# Altium schematic sheet 省电模块版v1.0.SchDoc
size A4
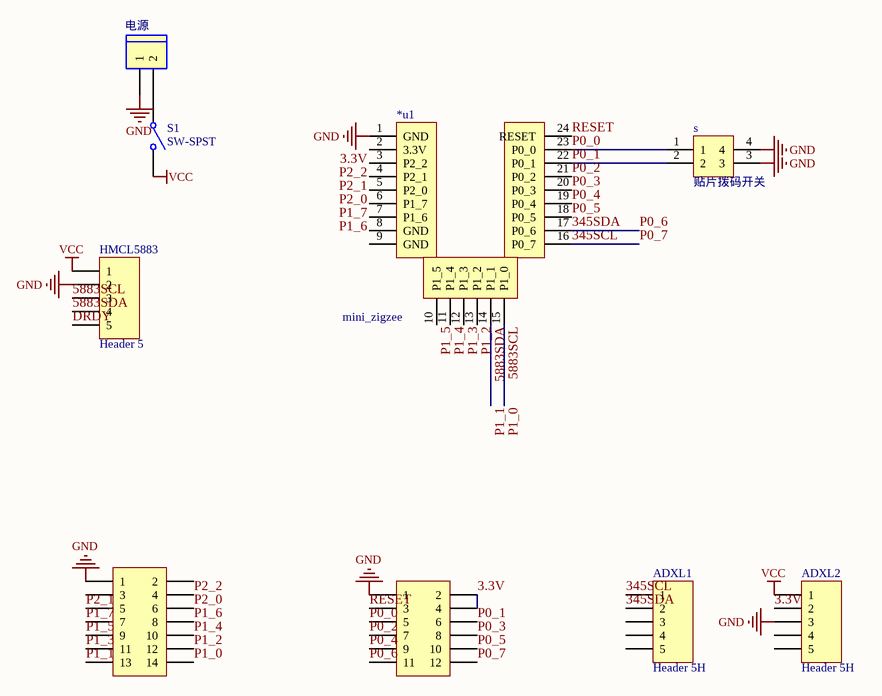
[diagram p0: 省电模块版v1.0.SchDoc]

## Parts
*u1  mini_zigzee  [mini_zigbee]
ADXL1  Header 5H  [HDR1X5]
ADXL2  Header 5H  [HDR1X5]
HMCL5883  Header 5  [HDR1X5]
JP2  Header 2X7  [HDR2-7]  (value not drawn)
JP3  Header 2X6  [HDR2-6]  (value not drawn)
s  贴片拨码开关  [贴片拨码开关]
S1  SW-SPST  [手电筒开关]
电源  (no value)  [HDR1X2]

## Nets
GND: *u1.1(GND) ADXL2.3 HMCL5883.2 JP2.1 JP3.1 s.3 s.4 电源.1
VCC: ADXL2.1 HMCL5883.1 S1.2(NO)
3.3V: *u1.2(3.3V) ADXL2.2 JP3.2 JP3.4
345SCL: *u1.16(P0_7) ADXL1.1 JP3.12  [also labelled P0_7]
345SDA: *u1.17(P0_6) ADXL1.2 JP3.11  [also labelled P0_6]
5883SCL: *u1.15(P1_0) HMCL5883.3 JP2.14  [also labelled P1_0]
5883SDA: *u1.14(P1_1) HMCL5883.4 JP2.13  [also labelled P1_1]
DRDY: HMCL5883.5
P0_0: *u1.23(P0_0) JP3.5 s.1
P0_1: *u1.22(P0_1) JP3.6 s.2
P0_2: *u1.21(P0_2) JP3.7
P0_3: *u1.20(P0_3) JP3.8
P0_4: *u1.19(P0_4) JP3.9
P0_5: *u1.18(P0_5) JP3.10
P1_2: *u1.13(P1_2) JP2.12
P1_3: *u1.12(P1_3) JP2.11
P1_4: *u1.11(P1_4) JP2.10
P1_5: *u1.10(P1_5) JP2.9
P1_6: *u1.7(P1_6) JP2.8
P1_7: *u1.6(P1_7) JP2.7
P2_0: *u1.5(P2_0) JP2.6
P2_1: *u1.4(P2_1) JP2.5
P2_2: *u1.3(P2_2) JP2.4
RESET: *u1.24(RESET) JP3.3
NetS1_1: S1.1(COMMON) 电源.2

Not connected (* = marked no-connect by the designer): *u1 8(GND) 9(GND); ADXL1 3 4 5; ADXL2 4 5; JP2 2 3

## Library data of the parts
ADXL1 ADXL2 = Header 5H: Header, 5-Pin, Right Angle; Revision: 17-Jul-2002: Re-released for DXP Platform.; Publisher: Altium Limited
HMCL5883 = Header 5: Header, 5-Pin; Revision: 17-Jul-2002: Re-released for DXP Platform.; Publisher: Altium Limited
JP2 = Header 2X7: Header, 7-Pin, Dual row; Manufacturer: Generic Components; Class: Connector
JP3 = Header 2X6: Header, 6-Pin, Dual row; Manufacturer: Generic Components; Class: Connector
S1 = SW-SPST: Single-Pole, Single-Throw Switch; Manufacturer: Generic Components; Published: 1999
电源 = H-2: Header, 2-Pin; Manufacturer: Generic Components; Class: Connector